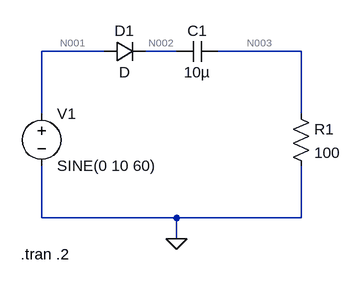
[diagram p0: schematic Basic 1st Circuit.asc]
Basic 1st Circuit.asc, the LTspice schematic file:
Version 4.1
SHEET 1 880 680
WIRE 48 144 -48 144
WIRE 160 144 112 144
WIRE 352 144 224 144
WIRE -48 240 -48 144
WIRE 352 240 352 144
WIRE -48 400 -48 320
WIRE 160 400 -48 400
WIRE 352 400 352 320
WIRE 352 400 160 400
WIRE 160 432 160 400
FLAG 160 432 0
SYMBOL voltage -48 224 R0
WINDOW 123 0 0 Left 0
WINDOW 39 0 0 Left 0
SYMATTR InstName V1
SYMATTR Value SINE(0 10 60)
SYMBOL res 336 224 R0
SYMATTR InstName R1
SYMATTR Value 100
SYMBOL cap 224 128 R90
WINDOW 0 0 32 VBottom 2
WINDOW 3 32 32 VTop 2
SYMATTR InstName C1
SYMATTR Value 10µ
SYMBOL diode 48 160 R270
WINDOW 0 32 32 VTop 2
WINDOW 3 0 32 VBottom 2
SYMATTR InstName D1
TEXT -80 456 Left 2 !.tran .2

The netlist it stands for:
* Basic 1st Circuit.asc
V1 N001 0 SINE(0 10 60)
R1 N003 0 100
C1 N003 N002 10µ
D1 N001 N002 D
.model D D
.lib standard.dio
.tran .2
.backanno
.end

* Results of the author's LTspice run, read from the files saved beside the schematic
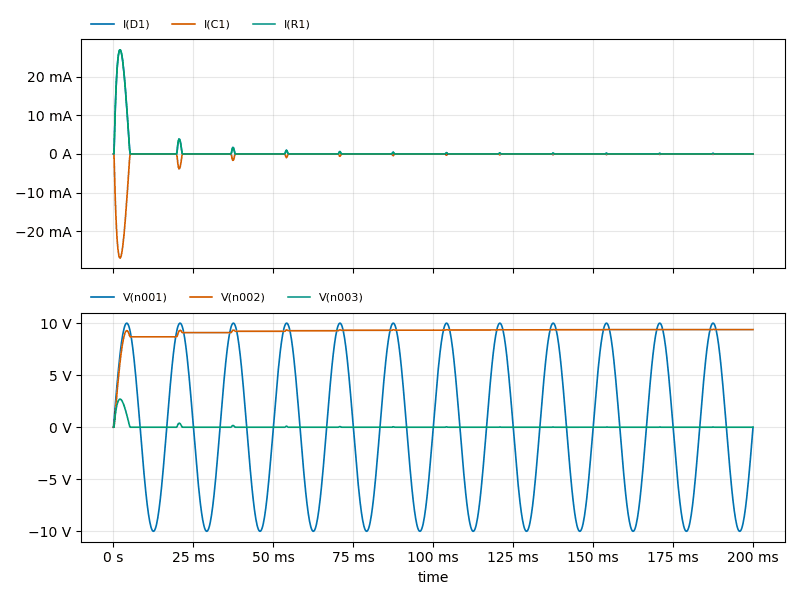
[diagram p1: Transient Analysis of Basic 1st Circuit.asc, plotted from the saved traces]
* Transient Analysis, 1 run:
*   I(D1): min 0 A, max 26.96 mA, average 469.3 µA, rms 3.058 mA, last 0 A
*   I(C1): min -26.96 mA, max 0 A, average -469.3 µA, rms 3.058 mA, last 0 A
*   I(R1): min 0 A, max 26.96 mA, average 469.3 µA, rms 3.058 mA, last 0 A
*   V(n001): min -10 V, max 10 V, average 0 V, rms 7.071 V, last 0 V
*   V(n002): min 0 V, max 9.396 V, average 9.188 V, rms 9.215 V, last 9.385 V
*   V(n003): min 0 V, max 2.696 V, average 46.93 mV, rms 305.8 mV, last 0 V